# Altium project IPTD_Project.PrjPcb
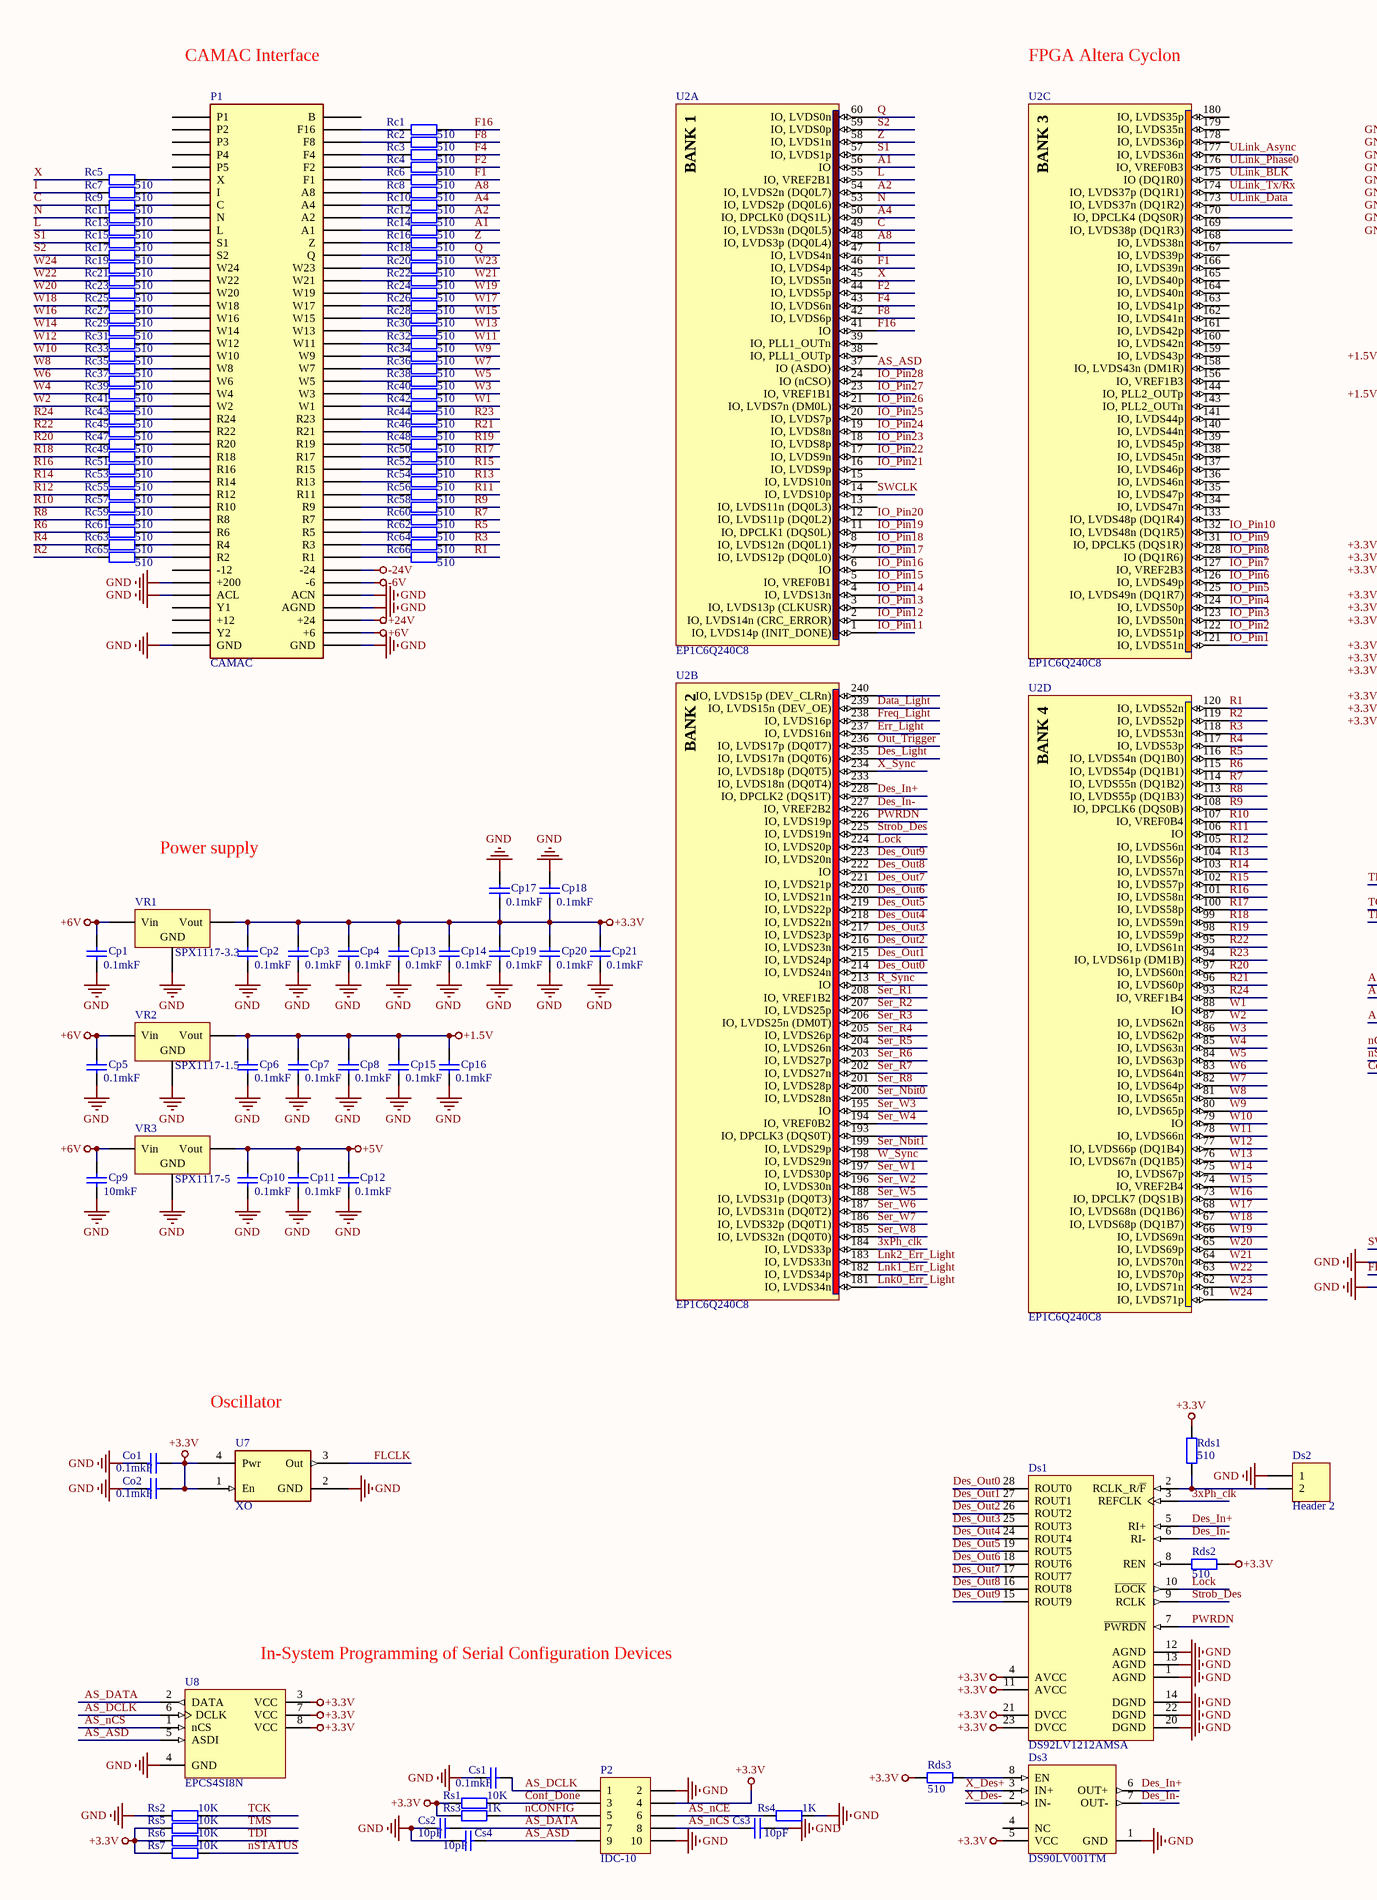
[diagram p0: IPTD.SchDoc, left]
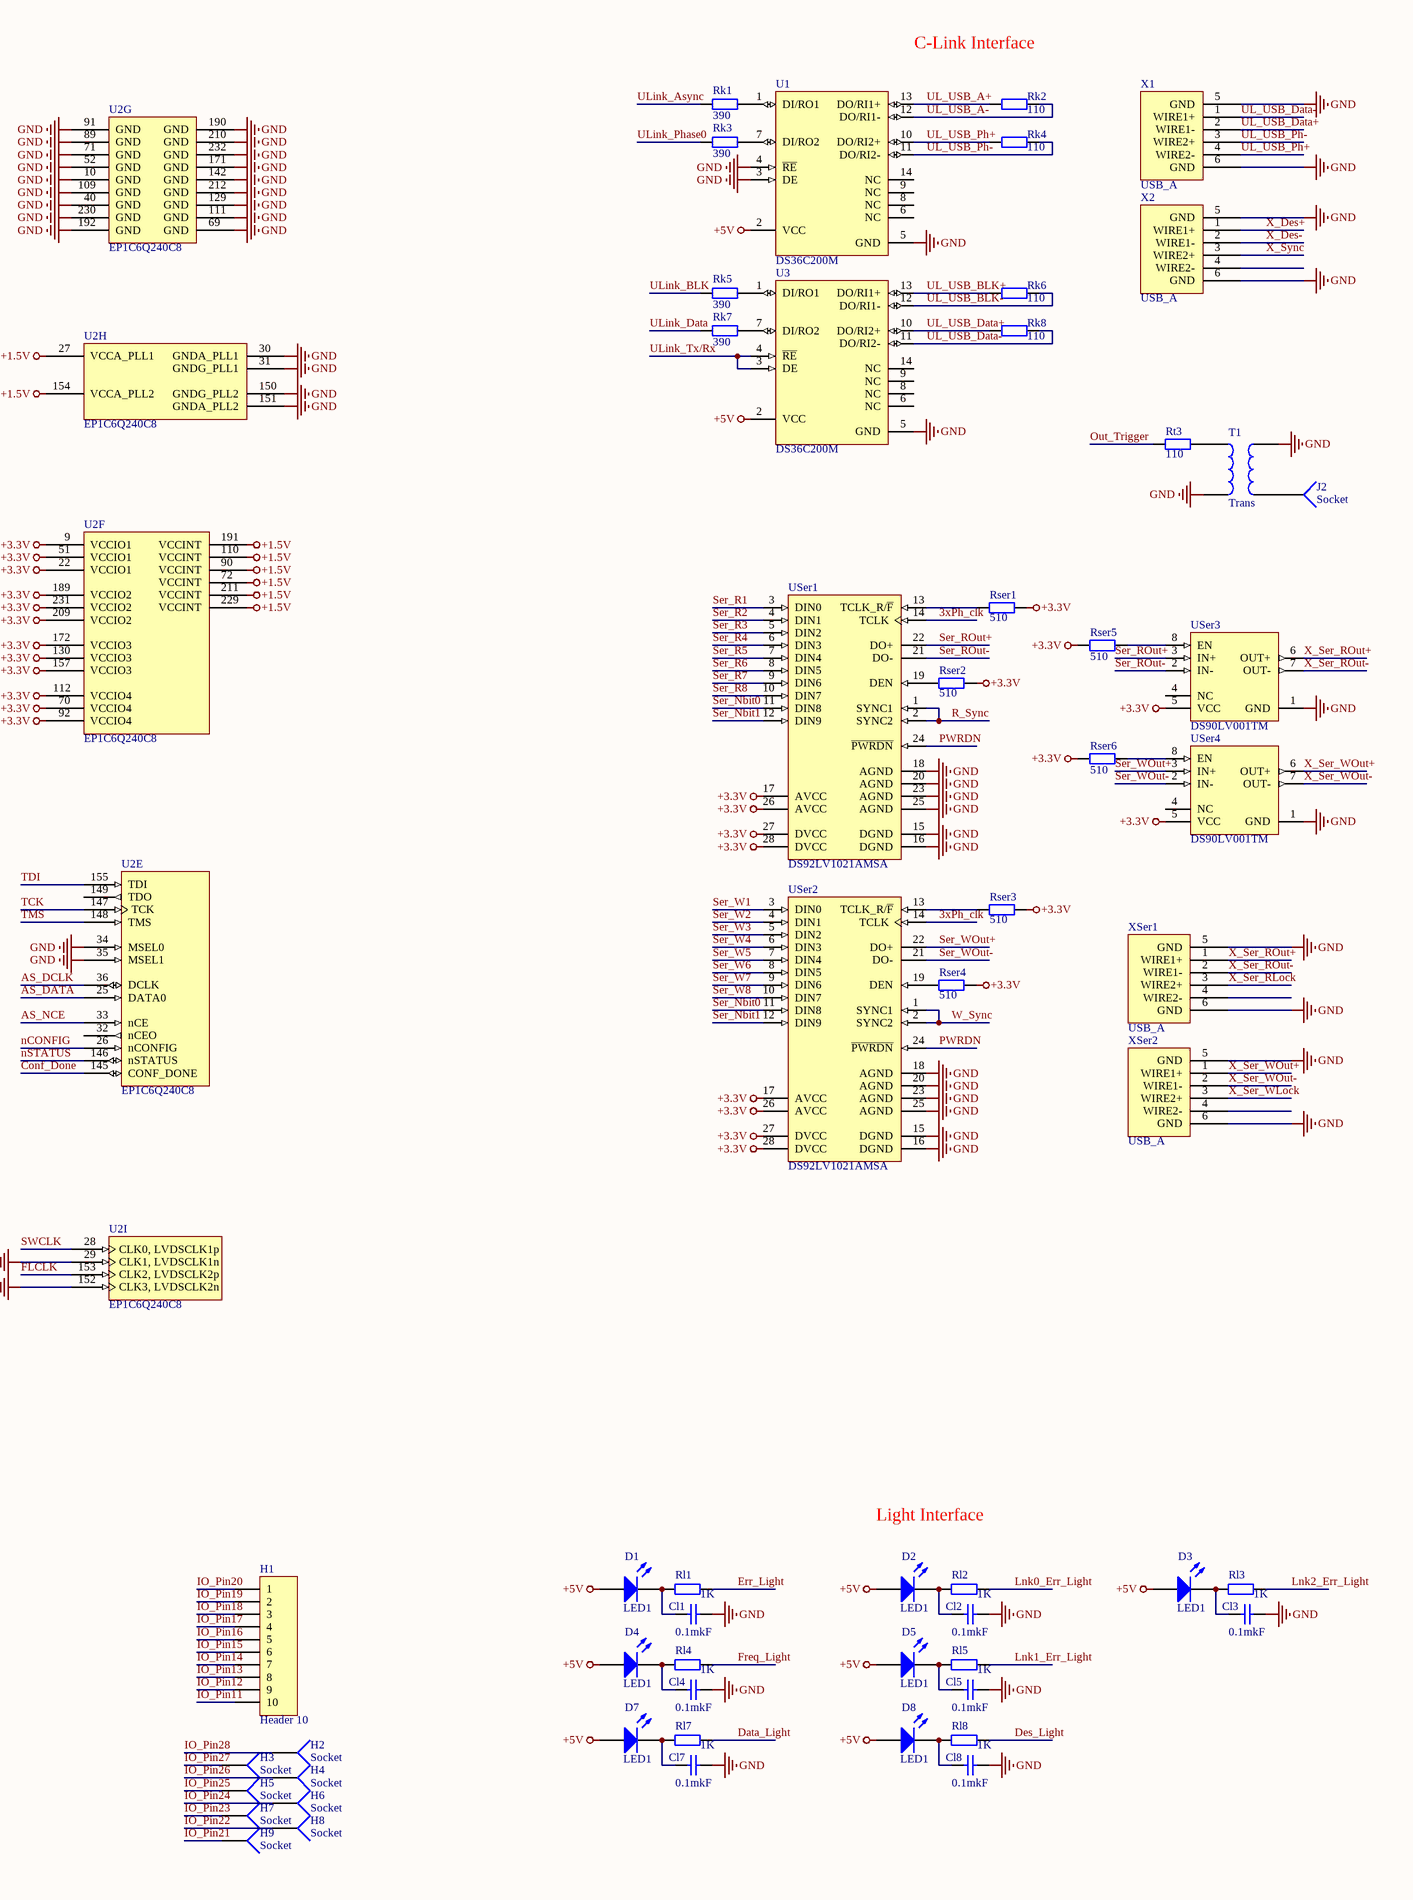
[diagram p1: IPTD.SchDoc, right]
1 sheet, 171 parts. Net scope: global (net labels, ports and power ports of the same name join across sheets).
Board file: IPTD.PcbDoc

## Sheet IPTD.SchDoc
size A2

### Parts
Cl1  value 0.1mkF  [6-0805_N]  (hidden comment: Cap)
Cl2  value 0.1mkF  [6-0805_N]  (hidden comment: Cap)
Cl3  value 0.1mkF  [6-0805_N]  (hidden comment: Cap)
Cl4  value 0.1mkF  [6-0805_N]  (hidden comment: Cap)
Cl5  value 0.1mkF  [6-0805_N]  (hidden comment: Cap)
Cl7  value 0.1mkF  [6-0805_N]  (hidden comment: Cap)
Cl8  value 0.1mkF  [6-0805_N]  (hidden comment: Cap)
Co1  value 0.1mkF  [6-0805_N]  (hidden comment: Cap)
Co2  value 0.1mkF  [6-0805_N]  (hidden comment: Cap)
Cp1  value 0.1mkF  [6-0805_N]  (hidden comment: Cap)
Cp2  value 0.1mkF  [6-0805_N]  (hidden comment: Cap)
Cp3  value 0.1mkF  [6-0805_N]  (hidden comment: Cap)
Cp4  value 0.1mkF  [6-0805_N]  (hidden comment: Cap)
Cp5  value 0.1mkF  [6-0805_N]  (hidden comment: Cap)
Cp6  value 0.1mkF  [6-0805_N]  (hidden comment: Cap)
Cp7  value 0.1mkF  [6-0805_N]  (hidden comment: Cap)
Cp8  value 0.1mkF  [6-0805_N]  (hidden comment: Cap)
Cp9  value 10mkF  [C1210_N]  (hidden comment: Cap)
Cp10  value 0.1mkF  [6-0805_N]  (hidden comment: Cap)
Cp11  value 0.1mkF  [6-0805_N]  (hidden comment: Cap)
Cp12  value 0.1mkF  [6-0805_N]  (hidden comment: Cap)
Cp13  value 0.1mkF  [6-0805_N]  (hidden comment: Cap)
Cp14  value 0.1mkF  [6-0805_N]  (hidden comment: Cap)
Cp15  value 0.1mkF  [6-0805_N]  (hidden comment: Cap)
Cp16  value 0.1mkF  [6-0805_N]  (hidden comment: Cap)
Cp17  value 0.1mkF  [6-0805_N]  (hidden comment: Cap)
Cp18  value 0.1mkF  [6-0805_N]  (hidden comment: Cap)
Cp19  value 0.1mkF  [6-0805_N]  (hidden comment: Cap)
Cp20  value 0.1mkF  [6-0805_N]  (hidden comment: Cap)
Cp21  value 0.1mkF  [6-0805_N]  (hidden comment: Cap)
Cs1  value 0.1mkF  [6-0805_N]  (hidden comment: Cap)
Cs2  value 10pF  [6-0805_N]  (hidden comment: Cap)
Cs3  value 10pF  [6-0805_N]  (hidden comment: Cap)
Cs4  value 10pF  [6-0805_N]  (hidden comment: Cap)
D1  LED1  [LED-1]
D2  LED1  [LED-1]
D3  LED1  [LED-1]
D4  LED1  [LED-1]
D5  LED1  [LED-1]
D7  LED1  [LED-1]
D8  LED1  [LED-1]
Ds1  DS92LV1212AMSA  [MSA28_N]
Ds2  Header 2  [HDR1X2]
Ds3  DS90LV001TM  [M08A_N]
H1  Header 10  [HDR1X10]
H2  Socket  [PIN1]
H3  Socket  [PIN1]
H4  Socket  [PIN1]
H5  Socket  [PIN1]
H6  Socket  [PIN1]
H7  Socket  [PIN1]
H8  Socket  [PIN1]
H9  Socket  [PIN1]
J2  Socket  [PIN1]
P1  CAMAC  [CAMAC]
P2  IDC-10  [HDR2X5]
Rc1  value 510  [6-0805_N]  (hidden comment: Res2)
Rc2  value 510  [6-0805_N]  (hidden comment: Res2)
Rc3  value 510  [6-0805_N]  (hidden comment: Res2)
Rc4  value 510  [6-0805_N]  (hidden comment: Res2)
Rc5  value 510  [6-0805_N]  (hidden comment: Res2)
Rc6  value 510  [6-0805_N]  (hidden comment: Res2)
Rc7  value 510  [6-0805_N]  (hidden comment: Res2)
Rc8  value 510  [6-0805_N]  (hidden comment: Res2)
Rc9  value 510  [6-0805_N]  (hidden comment: Res2)
Rc10  value 510  [6-0805_N]  (hidden comment: Res2)
Rc11  value 510  [6-0805_N]  (hidden comment: Res2)
Rc12  value 510  [6-0805_N]  (hidden comment: Res2)
Rc13  value 510  [6-0805_N]  (hidden comment: Res2)
Rc14  value 510  [6-0805_N]  (hidden comment: Res2)
Rc15  value 510  [6-0805_N]  (hidden comment: Res2)
Rc16  value 510  [6-0805_N]  (hidden comment: Res2)
Rc17  value 510  [6-0805_N]  (hidden comment: Res2)
Rc18  value 510  [6-0805_N]  (hidden comment: Res2)
Rc19  value 510  [6-0805_N]  (hidden comment: Res2)
Rc20  value 510  [6-0805_N]  (hidden comment: Res2)
Rc21  value 510  [6-0805_N]  (hidden comment: Res2)
Rc22  value 510  [6-0805_N]  (hidden comment: Res2)
Rc23  value 510  [6-0805_N]  (hidden comment: Res2)
Rc24  value 510  [6-0805_N]  (hidden comment: Res2)
Rc25  value 510  [6-0805_N]  (hidden comment: Res2)
Rc26  value 510  [6-0805_N]  (hidden comment: Res2)
Rc27  value 510  [6-0805_N]  (hidden comment: Res2)
Rc28  value 510  [6-0805_N]  (hidden comment: Res2)
Rc29  value 510  [6-0805_N]  (hidden comment: Res2)
Rc30  value 510  [6-0805_N]  (hidden comment: Res2)
Rc31  value 510  [6-0805_N]  (hidden comment: Res2)
Rc32  value 510  [6-0805_N]  (hidden comment: Res2)
Rc33  value 510  [6-0805_N]  (hidden comment: Res2)
Rc34  value 510  [6-0805_N]  (hidden comment: Res2)
Rc35  value 510  [6-0805_N]  (hidden comment: Res2)
Rc36  value 510  [6-0805_N]  (hidden comment: Res2)
Rc37  value 510  [6-0805_N]  (hidden comment: Res2)
Rc38  value 510  [6-0805_N]  (hidden comment: Res2)
Rc39  value 510  [6-0805_N]  (hidden comment: Res2)
Rc40  value 510  [6-0805_N]  (hidden comment: Res2)
Rc41  value 510  [6-0805_N]  (hidden comment: Res2)
Rc42  value 510  [6-0805_N]  (hidden comment: Res2)
Rc43  value 510  [6-0805_N]  (hidden comment: Res2)
Rc44  value 510  [6-0805_N]  (hidden comment: Res2)
Rc45  value 510  [6-0805_N]  (hidden comment: Res2)
Rc46  value 510  [6-0805_N]  (hidden comment: Res2)
Rc47  value 510  [6-0805_N]  (hidden comment: Res2)
Rc48  value 510  [6-0805_N]  (hidden comment: Res2)
Rc49  value 510  [6-0805_N]  (hidden comment: Res2)
Rc50  value 510  [6-0805_N]  (hidden comment: Res2)
Rc51  value 510  [6-0805_N]  (hidden comment: Res2)
Rc52  value 510  [6-0805_N]  (hidden comment: Res2)
Rc53  value 510  [6-0805_N]  (hidden comment: Res2)
Rc54  value 510  [6-0805_N]  (hidden comment: Res2)
Rc55  value 510  [6-0805_N]  (hidden comment: Res2)
Rc56  value 510  [6-0805_N]  (hidden comment: Res2)
Rc57  value 510  [6-0805_N]  (hidden comment: Res2)
Rc58  value 510  [6-0805_N]  (hidden comment: Res2)
Rc59  value 510  [6-0805_N]  (hidden comment: Res2)
Rc60  value 510  [6-0805_N]  (hidden comment: Res2)
Rc61  value 510  [6-0805_N]  (hidden comment: Res2)
Rc62  value 510  [6-0805_N]  (hidden comment: Res2)
Rc63  value 510  [6-0805_N]  (hidden comment: Res2)
Rc64  value 510  [6-0805_N]  (hidden comment: Res2)
Rc65  value 510  [6-0805_N]  (hidden comment: Res2)
Rc66  value 510  [6-0805_N]  (hidden comment: Res2)
Rds1  value 510  [6-0805_N]  (hidden comment: Res2)
Rds2  value 510  [6-0805_N]  (hidden comment: Res2)
Rds3  value 510  [6-0805_N]  (hidden comment: Res2)
Rk1  value 390  [6-0805_N]  (hidden comment: Res2)
Rk2  value 110  [6-0805_N]  (hidden comment: Res2)
Rk3  value 390  [6-0805_N]  (hidden comment: Res2)
Rk4  value 110  [6-0805_N]  (hidden comment: Res2)
Rk5  value 390  [6-0805_N]  (hidden comment: Res2)
Rk6  value 110  [6-0805_N]  (hidden comment: Res2)
Rk7  value 390  [6-0805_N]  (hidden comment: Res2)
Rk8  value 110  [6-0805_N]  (hidden comment: Res2)
Rl1  value 1K  [6-0805_N]  (hidden comment: Res2)
Rl2  value 1K  [6-0805_N]  (hidden comment: Res2)
Rl3  value 1K  [6-0805_N]  (hidden comment: Res2)
Rl4  value 1K  [6-0805_N]  (hidden comment: Res2)
Rl5  value 1K  [6-0805_N]  (hidden comment: Res2)
Rl7  value 1K  [6-0805_N]  (hidden comment: Res2)
Rl8  value 1K  [6-0805_N]  (hidden comment: Res2)
Rs1  value 10K  [6-0805_N]  (hidden comment: Res2)
Rs2  value 10K  [6-0805_N]  (hidden comment: Res2)
Rs3  value 1K  [6-0805_N]  (hidden comment: Res2)
Rs4  value 1K  [6-0805_N]  (hidden comment: Res2)
Rs5  value 10K  [6-0805_N]  (hidden comment: Res2)
Rs6  value 10K  [6-0805_N]  (hidden comment: Res2)
Rs7  value 10K  [6-0805_N]  (hidden comment: Res2)
Rser1  value 510  [6-0805_N]  (hidden comment: Res2)
Rser2  value 510  [6-0805_N]  (hidden comment: Res2)
Rser3  value 510  [6-0805_N]  (hidden comment: Res2)
Rser4  value 510  [6-0805_N]  (hidden comment: Res2)
Rser5  value 510  [6-0805_N]  (hidden comment: Res2)
Rser6  value 510  [6-0805_N]  (hidden comment: Res2)
Rt3  value 110  [6-0805_N]  (hidden comment: Res2)
T1  Trans  [TRANS]
U1  DS36C200M  [M14A_N]
U2  EP1C6Q240C8  [PQFP240_N]  (parts A,B,C,D,E,F,G,H,I of 9)
U3  DS36C200M  [M14A_N]
U7  XO  [XO_SMT]
U8  EPCS4SI8N  [SOIC8_N]
USer1  DS92LV1021AMSA  [MSA28_N]
USer2  DS92LV1021AMSA  [MSA28_N]
USer3  DS90LV001TM  [M08A_N]
USer4  DS90LV001TM  [M08A_N]
VR1  SPX1117-3.3  [TO228P970-3_4AN]
VR2  SPX1117-1.5  [TO228P970-3_4AN]
VR3  SPX1117-5  [TO228P970-3_4AN]
X1  USB_A  [USB2.5-2H4B]
X2  USB_A  [USB2.5-2H4B]
XSer1  USB_A  [USB2.5-2H4B]
XSer2  USB_A  [USB2.5-2H4B]

### Nets
+1.5V: Cp6.1 Cp7.1 Cp8.1 Cp15.1 Cp16.1 U2.27(VCCA_PLL1) U2.72(VCCINT) U2.90(VCCINT) U2.110(VCCINT) U2.154(VCCA_PLL2) U2.191(VCCINT) U2.211(VCCINT) U2.229(VCCINT) VR2.4(Vout)
+3.3V: Co1.2 Co2.2 Cp2.1 Cp3.1 Cp4.1 Cp13.1 Cp14.1 Cp17.2 Cp18.2 Cp19.1 Cp20.1 Cp21.1 Ds1.4(AVCC) Ds1.11(AVCC) Ds1.21(DVCC) Ds1.23(DVCC) Ds3.5(VCC) P2.4 Rds1.1 Rds2.2 Rds3.2 Rs1.2 Rs3.2 Rs5.2 Rs6.2 Rs7.2 Rser1.1 Rser2.2 Rser3.1 Rser4.2 Rser5.2 Rser6.2 U2.9(VCCIO1) U2.22(VCCIO1) U2.51(VCCIO1) U2.70(VCCIO4) U2.92(VCCIO4) U2.112(VCCIO4) U2.130(VCCIO3) U2.157(VCCIO3) U2.172(VCCIO3) U2.189(VCCIO2) U2.209(VCCIO2) U2.231(VCCIO2) U7.1(En) U7.4(Pwr) U8.3(VCC) U8.7(VCC) U8.8(VCC) USer1.17(AVCC) USer1.26(AVCC) USer1.27(DVCC) USer1.28(DVCC) USer2.17(AVCC) USer2.26(AVCC) USer2.27(DVCC) USer2.28(DVCC) USer3.5(VCC) USer4.5(VCC) VR1.4(Vout)
+5V: Cp10.1 Cp11.1 Cp12.1 D1.1(A) D2.1(A) D3.1(A) D4.1(A) D5.1(A) D7.1(A) D8.1(A) U1.2(VCC) U3.2(VCC) VR3.4(Vout)
+6V: Cp1.1 Cp5.1 Cp9.1 P1.+6 VR1.3(Vin) VR2.3(Vin) VR3.3(Vin)
+24V: P1.+24
-6V: P1.-6
-24V: P1.-24
GND: Cl1.2 Cl2.2 Cl3.2 Cl4.2 Cl5.2 Cl7.2 Cl8.2 Co1.1 Co2.1 Cp1.2 Cp2.2 Cp3.2 Cp4.2 Cp5.2 Cp6.2 Cp7.2 Cp8.2 Cp9.2 Cp10.2 Cp11.2 Cp12.2 Cp13.2 Cp14.2 Cp15.2 Cp16.2 Cp17.1 Cp18.1 Cp19.2 Cp20.2 Cp21.2 Cs1.2 Cs2.2 Cs3.1 Cs4.2 Ds1.1(AGND) Ds1.12(AGND) Ds1.13(AGND) Ds1.14(DGND) Ds1.20(DGND) Ds1.22(DGND) Ds2.1 Ds3.1(GND) P1.+200 P1.ACL P1.ACN P1.AGND P1.GND1(GND) P1.GND2(GND) P2.2 P2.10 Rs2.2 Rs4.1 T1.2 T1.3 U1.3(DE) U1.4(~{RE}) U1.5(GND) U2.10(GND) U2.29(CLK1,_LVDSCLK1n) U2.30(GNDA_PLL1) U2.31(GNDG_PLL1) U2.34(MSEL0) U2.35(MSEL1) U2.40(GND) U2.52(GND) U2.69(GND) U2.71(GND) U2.89(GND) U2.91(GND) U2.109(GND) U2.111(GND) U2.129(GND) U2.142(GND) U2.150(GNDG_PLL2) U2.151(GNDA_PLL2) U2.152(CLK3,_LVDSCLK2n) U2.171(GND) U2.190(GND) U2.192(GND) U2.210(GND) U2.212(GND) U2.230(GND) U2.232(GND) U3.5(GND) U7.2(GND) U8.4(GND) USer1.15(DGND) USer1.16(DGND) USer1.18(AGND) USer1.20(AGND) USer1.23(AGND) USer1.25(AGND) USer2.15(DGND) USer2.16(DGND) USer2.18(AGND) USer2.20(AGND) USer2.23(AGND) USer2.25(AGND) USer3.1(GND) USer4.1(GND) VR1.1(GND) VR2.1(GND) VR3.1(GND) X1.5(GND) X1.6(GND) X2.5(GND) X2.6(GND) XSer1.5(GND) XSer1.6(GND) XSer2.5(GND) XSer2.6(GND)
3xPh_clk: Ds1.3(REFCLK) U2.184(IO,_LVDS33p) USer1.14(TCLK) USer2.14(TCLK)
A1: Rc14.2 U2.56(IO)
A2: Rc12.2 U2.54(IO,_LVDS2n_(DQ0L7))
A4: Rc10.2 U2.50(IO,_DPCLK0_(DQS1L))
A8: Rc8.2 U2.48(IO,_LVDS3p_(DQ0L4))
AS_ASD: Cs4.1 P2.9 U2.37(IO_(ASDO)) U8.5(ASDI)
AS_DATA: Cs2.1 P2.7 U2.25(DATA0) U8.2(DATA)
AS_DCLK: Cs1.1 P2.1 U2.36(DCLK) U8.6(DCLK)
AS_nCE: P2.6 Rs4.2 U2.33(nCE)
AS_nCS: Cs3.2 P2.8 U8.1(nCS)
C: Rc9.1 U2.49(IO,_LVDS3n_(DQ0L5))
Conf_Done: P2.3 Rs1.1 U2.145(CONF_DONE)
Data_Light: Rl7.1 U2.239(IO,_LVDS15n_(DEV_OE))
Des_In+: Ds1.5(RI+) Ds3.6(OUT+) U2.228(IO,_DPCLK2_(DQS1T))
Des_In-: Ds1.6(RI-) Ds3.7(OUT-) U2.227(IO,_VREF2B2)
Des_Light: Rl8.1 U2.235(IO,_LVDS17n_(DQ0T6))
Des_Out0: Ds1.28(ROUT0) U2.214(IO,_LVDS24n)
Des_Out1: Ds1.27(ROUT1) U2.215(IO,_LVDS24p)
Des_Out2: Ds1.26(ROUT2) U2.216(IO,_LVDS23n)
Des_Out3: Ds1.25(ROUT3) U2.217(IO,_LVDS23p)
Des_Out4: Ds1.24(ROUT4) U2.218(IO,_LVDS22n)
Des_Out5: Ds1.19(ROUT5) U2.219(IO,_LVDS22p)
Des_Out6: Ds1.18(ROUT6) U2.220(IO,_LVDS21n)
Des_Out7: Ds1.17(ROUT7) U2.221(IO,_LVDS21p)
Des_Out8: Ds1.16(ROUT8) U2.222(IO)
Des_Out9: Ds1.15(ROUT9) U2.223(IO,_LVDS20n)
Err_Light: Rl1.1 U2.237(IO,_LVDS16n)
F1: Rc6.2 U2.46(IO,_LVDS4p)
F2: Rc4.2 U2.44(IO,_LVDS5p)
F4: Rc3.2 U2.43(IO,_LVDS6n)
F8: Rc2.2 U2.42(IO,_LVDS6p)
F16: Rc1.2 U2.41(IO)
FLCLK: U2.153(CLK2,_LVDSCLK2p) U7.3(Out)
Freq_Light: Rl4.1 U2.238(IO,_LVDS16p)
I: Rc7.1 U2.47(IO,_LVDS4n)
IO_Pin1: U2.121(IO,_LVDS51n)
IO_Pin2: U2.122(IO,_LVDS51p)
IO_Pin3: U2.123(IO,_LVDS50n)
IO_Pin4: U2.124(IO,_LVDS50p)
IO_Pin5: U2.125(IO,_LVDS49n_(DQ1R7))
IO_Pin6: U2.126(IO,_LVDS49p)
IO_Pin7: U2.127(IO,_VREF2B3)
IO_Pin8: U2.128(IO_(DQ1R6))
IO_Pin9: U2.131(IO,_DPCLK5_(DQS1R))
IO_Pin10: U2.132(IO,_LVDS48n_(DQ1R5))
IO_Pin11: H1.10 U2.1(IO,_LVDS14p_(INIT_DONE))
IO_Pin12: H1.9 U2.2(IO,_LVDS14n_(CRC_ERROR))
IO_Pin13: H1.8 U2.3(IO,_LVDS13p_(CLKUSR))
IO_Pin14: H1.7 U2.4(IO,_LVDS13n)
IO_Pin15: H1.6 U2.5(IO,_VREF0B1)
IO_Pin16: H1.5 U2.6(IO)
IO_Pin17: H1.4 U2.7(IO,_LVDS12p_(DQ0L0))
IO_Pin18: H1.3 U2.8(IO,_LVDS12n_(DQ0L1))
IO_Pin19: H1.2 U2.11(IO,_DPCLK1_(DQS0L))
IO_Pin20: H1.1 U2.12(IO,_LVDS11p_(DQ0L2))
IO_Pin21: H9.1 U2.16(IO,_LVDS9p)
IO_Pin22: H8.1 U2.17(IO,_LVDS9n)
IO_Pin23: H7.1 U2.18(IO,_LVDS8p)
IO_Pin24: H6.1 U2.19(IO,_LVDS8n)
IO_Pin25: H5.1 U2.20(IO,_LVDS7p)
IO_Pin26: H4.1 U2.21(IO,_LVDS7n_(DM0L))
IO_Pin27: H3.1 U2.23(IO,_VREF1B1)
IO_Pin28: H2.1 U2.24(IO_(nCSO))
L: Rc13.1 U2.55(IO,_VREF2B1)
Lnk0_Err_Light: Rl2.1 U2.181(IO,_LVDS34n)
Lnk1_Err_Light: Rl5.1 U2.182(IO,_LVDS34p)
Lnk2_Err_Light: Rl3.1 U2.183(IO,_LVDS33n)
Lock: Ds1.10(~{LOCK}) U2.224(IO,_LVDS20p)
N: Rc11.1 U2.53(IO,_LVDS2p_(DQ0L6))
nCONFIG: P2.5 Rs3.1 U2.26(nCONFIG)
nSTATUS: Rs7.1 U2.146(nSTATUS)
Out_Trigger: Rt3.1 U2.236(IO,_LVDS17p_(DQ0T7))
PWRDN: Ds1.7(~{PWRDN}) U2.226(IO,_LVDS19p) USer1.24(~{PWRDN}) USer2.24(~{PWRDN})
Q: Rc18.2 U2.60(IO,_LVDS0n)
R1: Rc66.2 U2.120(IO,_LVDS52n)
R2: Rc65.1 U2.119(IO,_LVDS52p)
R3: Rc64.2 U2.118(IO,_LVDS53n)
R4: Rc63.1 U2.117(IO,_LVDS53p)
R5: Rc62.2 U2.116(IO,_LVDS54n_(DQ1B0))
R6: Rc61.1 U2.115(IO,_LVDS54p_(DQ1B1))
R7: Rc60.2 U2.114(IO,_LVDS55n_(DQ1B2))
R8: Rc59.1 U2.113(IO,_LVDS55p_(DQ1B3))
R9: Rc58.2 U2.108(IO,_DPCLK6_(DQS0B))
R10: Rc57.1 U2.107(IO,_VREF0B4)
R11: Rc56.2 U2.106(IO)
R12: Rc55.1 U2.105(IO,_LVDS56n)
R13: Rc54.2 U2.104(IO,_LVDS56p)
R14: Rc53.1 U2.103(IO,_LVDS57n)
R15: Rc52.2 U2.102(IO,_LVDS57p)
R16: Rc51.1 U2.101(IO,_LVDS58n)
R17: Rc50.2 U2.100(IO,_LVDS58p)
R18: Rc49.1 U2.99(IO,_LVDS59n)
R19: Rc48.2 U2.98(IO,_LVDS59p)
R20: Rc47.1 U2.97(IO,_LVDS60n)
R21: Rc46.2 U2.96(IO,_LVDS60p)
R22: Rc45.1 U2.95(IO,_LVDS61n)
R23: Rc44.2 U2.94(IO,_LVDS61p_(DM1B))
R24: Rc43.1 U2.93(IO,_VREF1B4)
R_Sync: U2.213(IO) USer1.1(SYNC1) USer1.2(SYNC2)
S1: Rc15.1 U2.57(IO,_LVDS1p)
S2: Rc17.1 U2.59(IO,_LVDS0p)
Ser_Nbit0: U2.200(IO,_LVDS28n) USer1.11(DIN8) USer2.11(DIN8)
Ser_Nbit1: U2.199(IO,_LVDS29p) USer1.12(DIN9) USer2.12(DIN9)
Ser_R1: U2.208(IO,_VREF1B2) USer1.3(DIN0)
Ser_R2: U2.207(IO,_LVDS25p) USer1.4(DIN1)
Ser_R3: U2.206(IO,_LVDS25n_(DM0T)) USer1.5(DIN2)
Ser_R4: U2.205(IO,_LVDS26p) USer1.6(DIN3)
Ser_R5: U2.204(IO,_LVDS26n) USer1.7(DIN4)
Ser_R6: U2.203(IO,_LVDS27p) USer1.8(DIN5)
Ser_R7: U2.202(IO,_LVDS27n) USer1.9(DIN6)
Ser_R8: U2.201(IO,_LVDS28p) USer1.10(DIN7)
Ser_ROut+: USer1.22(DO+) USer3.3(IN+)
Ser_ROut-: USer1.21(DO-) USer3.2(IN-)
Ser_W1: U2.197(IO,_LVDS30p) USer2.3(DIN0)
Ser_W2: U2.196(IO,_LVDS30n) USer2.4(DIN1)
Ser_W3: U2.195(IO) USer2.5(DIN2)
Ser_W4: U2.194(IO,_VREF0B2) USer2.6(DIN3)
Ser_W5: U2.188(IO,_LVDS31p_(DQ0T3)) USer2.7(DIN4)
Ser_W6: U2.187(IO,_LVDS31n_(DQ0T2)) USer2.8(DIN5)
Ser_W7: U2.186(IO,_LVDS32p_(DQ0T1)) USer2.9(DIN6)
Ser_W8: U2.185(IO,_LVDS32n_(DQ0T0)) USer2.10(DIN7)
Ser_WOut+: USer2.22(DO+) USer4.3(IN+)
Ser_WOut-: USer2.21(DO-) USer4.2(IN-)
Strob_Des: Ds1.9(RCLK) U2.225(IO,_LVDS19n)
SWCLK: U2.14(IO,_LVDS10p) U2.28(CLK0,_LVDSCLK1p)
TCK: Rs2.1 U2.147(TCK)
TDI: Rs6.1 U2.155(TDI)
TMS: Rs5.1 U2.148(TMS)
UL_USB_A+: Rk2.2 U1.13(DO/RI1+)
UL_USB_A-: Rk2.1 U1.12(DO/RI1-)
UL_USB_BLK+: Rk6.2 U3.13(DO/RI1+)
UL_USB_BLK-: Rk6.1 U3.12(DO/RI1-)
UL_USB_Data+: Rk8.2 U3.10(DO/RI2+) X1.2(WIRE1-)
UL_USB_Data-: Rk8.1 U3.11(DO/RI2-) X1.1(WIRE1+)
UL_USB_Ph+: Rk4.2 U1.10(DO/RI2+) X1.4(WIRE2-)
UL_USB_Ph-: Rk4.1 U1.11(DO/RI2-) X1.3(WIRE2+)
ULink_Async: Rk1.2 U2.177(IO,_LVDS36n)
ULink_BLK: Rk5.2 U2.175(IO_(DQ1R0))
ULink_Data: Rk7.2 U2.173(IO,_LVDS37n_(DQ1R2))
ULink_Phase0: Rk3.2 U2.176(IO,_VREF0B3)
ULink_Tx/Rx: U2.174(IO,_LVDS37p_(DQ1R1)) U3.3(DE) U3.4(~{RE})
W1: Rc42.2 U2.88(IO)
W2: Rc41.1 U2.87(IO,_LVDS62n)
W3: Rc40.2 U2.86(IO,_LVDS62p)
W4: Rc39.1 U2.85(IO,_LVDS63n)
W5: Rc38.2 U2.84(IO,_LVDS63p)
W6: Rc37.1 U2.83(IO,_LVDS64n)
W7: Rc36.2 U2.82(IO,_LVDS64p)
W8: Rc35.1 U2.81(IO,_LVDS65n)
W9: Rc34.2 U2.80(IO,_LVDS65p)
W10: Rc33.1 U2.79(IO)
W11: Rc32.2 U2.78(IO,_LVDS66n)
W12: Rc31.1 U2.77(IO,_LVDS66p_(DQ1B4))
W13: Rc30.2 U2.76(IO,_LVDS67n_(DQ1B5))
W14: Rc29.1 U2.75(IO,_LVDS67p)
W15: Rc28.2 U2.74(IO,_VREF2B4)
W16: Rc27.1 U2.73(IO,_DPCLK7_(DQS1B))
W17: Rc26.2 U2.68(IO,_LVDS68n_(DQ1B6))
W18: Rc25.1 U2.67(IO,_LVDS68p_(DQ1B7))
W19: Rc24.2 U2.66(IO,_LVDS69n)
W20: Rc23.1 U2.65(IO,_LVDS69p)
W21: Rc22.2 U2.64(IO,_LVDS70n)
W22: Rc21.1 U2.63(IO,_LVDS70p)
W23: Rc20.2 U2.62(IO,_LVDS71n)
W24: Rc19.1 U2.61(IO,_LVDS71p)
W_Sync: U2.198(IO,_LVDS29n) USer2.1(SYNC1) USer2.2(SYNC2)
X: Rc5.1 U2.45(IO,_LVDS5n)
X_Des+: Ds3.3(IN+) X2.1(WIRE1+)
X_Des-: Ds3.2(IN-) X2.2(WIRE1-)
X_Ser_RLock: XSer1.3(WIRE2+)
X_Ser_ROut+: USer3.6(OUT+) XSer1.1(WIRE1+)
X_Ser_ROut-: USer3.7(OUT-) XSer1.2(WIRE1-)
X_Ser_WLock: XSer2.3(WIRE2+)
X_Ser_WOut+: USer4.6(OUT+) XSer2.1(WIRE1+)
X_Ser_WOut-: USer4.7(OUT-) XSer2.2(WIRE1-)
X_Sync: U2.234(IO,_LVDS18p_(DQ0T5)) X2.3(WIRE2+)
Z: Rc16.2 U2.58(IO,_LVDS1n)
NetCl1_1: Cl1.1 D1.2(K) Rl1.2
NetCl2_1: Cl2.1 D2.2(K) Rl2.2
NetCl3_1: Cl3.1 D3.2(K) Rl3.2
NetCl4_1: Cl4.1 D4.2(K) Rl4.2
NetCl5_1: Cl5.1 D5.2(K) Rl5.2
NetCl7_1: Cl7.1 D7.2(K) Rl7.2
NetCl8_1: Cl8.1 D8.2(K) Rl8.2
NetDs1_2: Ds1.2(RCLK_R/~{F}) Ds2.2 Rds1.2
NetDs1_8: Ds1.8(REN) Rds2.1
NetDs3_8: Ds3.8(EN) Rds3.1
NetJ2_1: J2.1 T1.4
NetP1_A1: P1.A1 Rc14.1
NetP1_A2: P1.A2 Rc12.1
NetP1_A4: P1.A4 Rc10.1
NetP1_A8: P1.A8 Rc8.1
NetP1_C: P1.C Rc9.2
NetP1_F1: P1.F1 Rc6.1
NetP1_F2: P1.F2 Rc4.1
NetP1_F4: P1.F4 Rc3.1
NetP1_F8: P1.F8 Rc2.1
NetP1_F16: P1.F16 Rc1.1
NetP1_I: P1.I Rc7.2
NetP1_L: P1.L Rc13.2
NetP1_N: P1.N Rc11.2
NetP1_Q: P1.Q Rc18.1
NetP1_R1: P1.R1 Rc66.1
NetP1_R2: P1.R2 Rc65.2
NetP1_R3: P1.R3 Rc64.1
NetP1_R4: P1.R4 Rc63.2
NetP1_R5: P1.R5 Rc62.1
NetP1_R6: P1.R6 Rc61.2
NetP1_R7: P1.R7 Rc60.1
NetP1_R8: P1.R8 Rc59.2
NetP1_R9: P1.R9 Rc58.1
NetP1_R10: P1.R10 Rc57.2
NetP1_R11: P1.R11 Rc56.1
NetP1_R12: P1.R12 Rc55.2
NetP1_R13: P1.R13 Rc54.1
NetP1_R14: P1.R14 Rc53.2
NetP1_R15: P1.R15 Rc52.1
NetP1_R16: P1.R16 Rc51.2
NetP1_R17: P1.R17 Rc50.1
NetP1_R18: P1.R18 Rc49.2
NetP1_R19: P1.R19 Rc48.1
NetP1_R20: P1.R20 Rc47.2
NetP1_R21: P1.R21 Rc46.1
NetP1_R22: P1.R22 Rc45.2
NetP1_R23: P1.R23 Rc44.1
NetP1_R24: P1.R24 Rc43.2
NetP1_S1: P1.S1 Rc15.2
NetP1_S2: P1.S2 Rc17.2
NetP1_W1: P1.W1 Rc42.1
NetP1_W2: P1.W2 Rc41.2
NetP1_W3: P1.W3 Rc40.1
NetP1_W4: P1.W4 Rc39.2
NetP1_W5: P1.W5 Rc38.1
NetP1_W6: P1.W6 Rc37.2
NetP1_W7: P1.W7 Rc36.1
NetP1_W8: P1.W8 Rc35.2
NetP1_W9: P1.W9 Rc34.1
NetP1_W10: P1.W10 Rc33.2
NetP1_W11: P1.W11 Rc32.1
NetP1_W12: P1.W12 Rc31.2
NetP1_W13: P1.W13 Rc30.1
NetP1_W14: P1.W14 Rc29.2
NetP1_W15: P1.W15 Rc28.1
NetP1_W16: P1.W16 Rc27.2
NetP1_W17: P1.W17 Rc26.1
NetP1_W18: P1.W18 Rc25.2
NetP1_W19: P1.W19 Rc24.1
NetP1_W20: P1.W20 Rc23.2
NetP1_W21: P1.W21 Rc22.1
NetP1_W22: P1.W22 Rc21.2
NetP1_W23: P1.W23 Rc20.1
NetP1_W24: P1.W24 Rc19.2
NetP1_X: P1.X Rc5.2
NetP1_Z: P1.Z Rc16.1
NetRk1_1: Rk1.1 U1.1(DI/RO1)
NetRk3_1: Rk3.1 U1.7(DI/RO2)
NetRk5_1: Rk5.1 U3.1(DI/RO1)
NetRk7_1: Rk7.1 U3.7(DI/RO2)
NetRser1_2: Rser1.2 USer1.13(TCLK_R/~{F})
NetRser2_1: Rser2.1 USer1.19(DEN)
NetRser3_2: Rser3.2 USer2.13(TCLK_R/~{F})
NetRser4_1: Rser4.1 USer2.19(DEN)
NetRser5_1: Rser5.1 USer3.8(EN)
NetRser6_1: Rser6.1 USer4.8(EN)
NetRt3_2: Rt3.2 T1.1

Not connected (* = marked no-connect by the designer): Ds3 4(NC); P1 +12 -12 B P1 P2 P3 P4 P5 Y1 Y2; U1 6(NC) 8(NC) 9(NC) 14(NC); U2 13(IO,_LVDS11n_(DQ0L3)) 15(IO,_LVDS10n) 32(nCEO) 38(IO,_PLL1_OUTp) 39(IO,_PLL1_OUTn) 133(IO,_LVDS48p_(DQ1R4)) 134(IO,_LVDS47n) 135(IO,_LVDS47p) 136(IO,_LVDS46n) 137(IO,_LVDS46p) 138(IO,_LVDS45n) 139(IO,_LVDS45p) 140(IO,_LVDS44n) 141(IO,_LVDS44p) 143(IO,_PLL2_OUTn) 144(IO,_PLL2_OUTp) 149(TDO) 156(IO,_VREF1B3) 158(IO,_LVDS43n_(DM1R)) 159(IO,_LVDS43p) 160(IO,_LVDS42n) 161(IO,_LVDS42p) 162(IO,_LVDS41n) 163(IO,_LVDS41p) 164(IO,_LVDS40n) 165(IO,_LVDS40p) 166(IO,_LVDS39n) 167(IO,_LVDS39p) 168(IO,_LVDS38n) 169(IO,_LVDS38p_(DQ1R3)) 170(IO,_DPCLK4_(DQS0R)) 178(IO,_LVDS36p) 179(IO,_LVDS35n) 180(IO,_LVDS35p) 193(IO,_DPCLK3_(DQS0T)) 233(IO,_LVDS18n_(DQ0T4)) 240(IO,_LVDS15p_(DEV_CLRn)); U3 6(NC) 8(NC) 9(NC) 14(NC); USer3 4(NC); USer4 4(NC); X2 4(WIRE2-); XSer1 4(WIRE2-); XSer2 4(WIRE2-)

### Notes on the sheet
- CAMAC Interface
- FPGA Altera Cyclon
- C-Link Interface
- Power supply
- Oscillator
- Light Interface
- (near U8) In-System Programming of Serial Configuration Devices
- (in symbol EP1C6Q240C8, part A) BANK 1
- (in symbol EP1C6Q240C8, part B) BANK 2
- (in symbol EP1C6Q240C8, part C) BANK 3
- (in symbol EP1C6Q240C8, part D) BANK 4

### Library data of the parts
Cl1-Cl5 Cl7 Cl8 Co1 Co2 Cp1-Cp21 Cs1-Cs4 = Cap: Capacitor; Published: 8-Jun-2000; LatestRevisionDate: 17-Jul-2002; LatestRevisionNote: Re-released for DXP Platform.; PackageReference: RAD-0.3; Publisher: Altium Limited; PackageDescription: Radial Cap, Thru-Hole; 2 Leads; 0.3 in Pin Spacing
D1-D5 D7 D8 = LED1: Typical RED GaAs LED; Published: 8-Jun-2000; LatestRevisionDate: 08-Jul-2005; LatestRevisionNote: Mech Layer 1 removed.; PackageReference: LED-1; Publisher: Altium Limited; PackageDescription: LED; 2 Leads
Ds1 = DS92LV1212AMSA: 16 MHz - 40 MHz 10-Bit Bus LVDS Random Lock Deserializer with Embedded Clock Recovery, 28-pin SSOP-EIAJ; Manufacturer: National Semiconductor; PackageTopMarking: NSUZXYTTE#*DS92LV1212A*MSA; PowerWise: N; CompType: Interface IC; Published: 4-Dec-2008; DatasheetVersion: Nov-2000; PackageVersion: revC, Oct-2009; PackageReference: MSA28; Publisher: Altium Limited; PackageDescription: Molded SSOP, 5.3mm Body Width, 0.65mm Pitch, EIAJ, Type II, 28 Lead; Supplier 1: Farnell; Supplier Part Number 1: 7610683; PartNumber: DS92LV1212AMSA; RoHS: N; PinCount: 28; Code_IPC: SOP65P780-28; ComponentLink1Description: DS92LV1212A Datasheet; ComponentLink1URL: http://www.national.com/ds/DS/DS92LV1212A.pdf; ComponentLink2Description: DS92LV1212A Web Page; ComponentLink2URL: http://www.national.com/pf/DS/DS92LV1212A.html; ComponentLink3Description: MSA28 Package Page; ComponentLink3URL: http://www.national.com/packaging/folders/msa28.html
Ds2 = Header 2: Header, 2-Pin; LatestRevisionDate: 17-Jul-2002; LatestRevisionNote: Re-released for DXP Platform.; Publisher: Altium Limited
Ds3 USer3 USer4 = DS90LV001TM: 800 Mbps LVDS Buffer, 8-pin Narrow SOIC; Manufacturer: National Semiconductor; PackageTopMarking: NSZXTT*LV001*TM; PowerWise: N; CompType: Interface IC; Published: 4-Dec-2008; DatasheetVersion: Feb-2008; PackageVersion: revM, May-2009; PackageReference: M08A; Publisher: Altium Limited; PackageDescription: SOIC Narrow, 4.9 x 3.9 x 1.45mm, 8 Lead, 1.27mm Pitch; PartNumber: DS90LV001TM; RoHS: N; PinCount: 8; Code_JEDEC: MS-012-AA; Code_IPC: SOIC127P600-8; ComponentLink1Description: DS90LV001 Datasheet; ComponentLink1URL: http://www.national.com/ds/DS/DS90LV001.pdf; ComponentLink2Description: DS90LV001 Web Page; ComponentLink2URL: http://www.national.com/pf/DS/DS90LV001.html; ComponentLink3Description: M08A Package Page; ComponentLink3URL: http://www.national.com/packaging/folders/m08a.html
H1 = Header 10: Header, 10-Pin; LatestRevisionDate: 17-Jul-2002; LatestRevisionNote: Re-released for DXP Platform.; Publisher: Altium Limited
P1 = CAMAC: CAMAC module; Published: 8-Jun-2000; LatestRevisionDate: 17-Jul-2002; LatestRevisionNote: Re-released for DXP Platform.; PackageReference: SMB; Publisher: Altium Limited; PackageDescription: DO-214-AA/SMB; 2 C-Bend Leads; Body 5.3 x 3.6 mm, inc. leads (LxW); Code_JEDEC: DO-214-AA
P2 = Header 5X2: Header, 5-Pin, Dual row; LatestRevisionDate: 17-Jul-2002; LatestRevisionNote: Re-released for DXP Platform.; Publisher: Altium Limited
Rc1-Rc66 Rds1-Rds3 Rk1-Rk8 Rl1-Rl5 Rl7 Rl8 Rs1-Rs7 Rser1-Rser6 Rt3 = Res2: Resistor; Published: 8-Jun-2000; LatestRevisionDate: 17-Jul-2002; LatestRevisionNote: Re-released for DXP Platform.; PackageReference: AXIAL-0.4; Publisher: Altium Limited; PackageDescription: Axial Device, Thru-Hole; 2 Leads; 0.4 in Pin Spacing
T1 = Trans: Transformer; Published: 24-Mar-1999; LatestRevisionDate: 08-Jul-2005; LatestRevisionNote: Mech Layer 1 removed.; PackageReference: TRANS; Publisher: Altium Limited; PackageDescription: Transformer; 4 Leads
U1 U3 = DS36C200M: Dual High Speed Bi-Directional Differential Transceiver, 14-pin Narrow SOIC; Manufacturer: National Semiconductor; PackageTopMarking: NSUZXYTTE#*DS36C200M; PowerWise: N; CompType: Interface IC; Published: 4-Dec-2008; DatasheetVersion: Feb-2005; PackageVersion: revJ, Jan-1996; PackageReference: M14A; Publisher: Altium Limited; PackageDescription: Molded Package S.O., .150in Wide, 14 Lead; Supplier 1: Farnell; Supplier Part Number 1: 9494189; PartNumber: DS36C200M; RoHS: N; PinCount: 14; Code_JEDEC: MS-012AB; Code_IPC: SOIC127P600-14; ComponentLink1Description: DS36C200 Datasheet; ComponentLink1URL: http://www.national.com/ds/DS/DS36C200.pdf; ComponentLink2Description: DS36C200 Web Page; ComponentLink2URL: http://www.national.com/pf/DS/DS36C200.html; ComponentLink3Description: M14A Package Page; ComponentLink3URL: http://www.national.com/packaging/folders/m14a.html
U2 = EP1C6Q240C8: Cyclone Family, 1.5V FPGA, 185 I/O Pins, 2 x PLLs, Commercial Grade, Speed Grade 8; Published: 17-Sep-2003; LatestRevisionDate: 13-Apr-2006; LatestRevisionNote: Pin 2 name fix, IPC-7351 Footprint Added.; DatasheetVersion: ver2.4, May-2008; PackageVersion: ver15.4, Dec-2008; PackageReference: PQFP240; Publisher: Altium Limited; PackageDescription: 240-Pin Plastic Quad Flat Pack (PQFP240) - Wire Bond; Supplier 1: Digi-Key; Supplier Part Number 1: 544-1085-ND; Code_JEDEC: MS-029-GA; ComponentLink1Description: Manufacturer Link; ComponentLink1URL: http://www.altera.com/products/devices/cyclone/cyc-index.jsp; ComponentLink2Description: Handbook; ComponentLink2URL: http://www.altera.com/literature/hb/cyc/cyc_c5v1.pdf; ComponentLink3Description: Packaging Specification; ComponentLink3URL: http://www.altera.com/literature/ds/dspkg.pdf
U7 = XO: XO (quartz); Published: 8-Jun-2000; LatestRevisionDate: 17-Jul-2002; LatestRevisionNote: Re-released for DXP Platform.; PackageReference: SMB; Publisher: Altium Limited; PackageDescription: DO-214-AA/SMB; 2 C-Bend Leads; Body 5.3 x 3.6 mm, inc. leads (LxW); Code_JEDEC: DO-214-AA
U8 = EPCS4SI8N: EPCS4 Series, In-system programmable 3.3V serial configuration device, 8-Pin SOIC, 4-Megabit, Industrial Grade, Pb-Free; Configures: Cyclone II, Stratix II, & Cyclone Devices; Published: 4-Mar-2005; LatestRevisionDate: 13-Apr-2006; LatestRevisionNote: IPC-7351 Footprint Added.; DatasheetVersion: ver2.0, Oct-2003; PackageVersion: ver14.2, Oct-2005; PackageReference: SOIC8; Publisher: Altium Limited; PackageDescription: 8-Pin Small Outline Integrated Circuit Package (SOIC8); Supplier 1: Digi-Key; Supplier Part Number 1: 544-1379-5-ND; Supplier 2: Farnell; Supplier Part Number 2: 1662262; Supplier 3: Farnell; Supplier Part Number 3: 1453496; Code_JEDEC: MS-012-AA; Code_IPC: SOIC127P600-8; ComponentLink1Description: Manufacturer Link; ComponentLink1URL: http://www.altera.com/products/devices/config/cfg-index.html; ComponentLink2Description: Configuration Handbook; ComponentLink2URL: http://www.altera.com/literature/hb/cfg/config_handbook.pdf; ComponentLink3Description: Pinout Specification; ComponentLink3URL: http://www.altera.com/literature/hb/cfg/cyc_c51014.pdf; ComponentLink4Description: Packaging Specification; ComponentLink4URL: http://www.altera.com/literature/ds/dspkg.pdf
USer1 USer2 = DS92LV1021AMSA: 16 MHz - 40 MHz 10-Bit Serializer, 28-pin SSOP-EIAJ; Manufacturer: National Semiconductor; PackageTopMarking: NSUZXYTTE#*DS92LV1021A*MSA BBBBB; PowerWise: N; CompType: Interface IC; Published: 4-Dec-2008; DatasheetVersion: Jan-2003; PackageVersion: revC, Oct-2009; PackageReference: MSA28; Publisher: Altium Limited; PackageDescription: Molded SSOP, 5.3mm Body Width, 0.65mm Pitch, EIAJ, Type II, 28 Lead; Supplier 1: Farnell; Supplier Part Number 1: 8206830; PartNumber: DS92LV1021AMSA; RoHS: N; PinCount: 28; Code_IPC: SOP65P780-28; ComponentLink1Description: DS92LV1021A Datasheet; ComponentLink1URL: http://www.national.com/ds/DS/DS92LV1021A.pdf; ComponentLink2Description: DS92LV1021A Web Page; ComponentLink2URL: http://www.national.com/pf/DS/DS92LV1021A.html; ComponentLink3Description: MSA28 Package Page; ComponentLink3URL: http://www.national.com/packaging/folders/msa28.html
VR1-VR3 = Volt Reg: Voltage Regulator; Published: 24-Mar-1999; LatestRevisionDate: 29-May-2009; LatestRevisionNote: IPC-7351 Footprint Added.; PackageReference: D2PAK; Publisher: Altium Limited; PackageDescription: 3-Pin Transistor Outline Package 2.54 mm Pitch, 15.1 mm Lead Span
X1 X2 XSer1 XSer2 = USB_A: Connector USB A; Published: 8-Jun-2000; LatestRevisionDate: 17-Jul-2002; LatestRevisionNote: Re-released for DXP Platform.; PackageReference: SMB; Publisher: Altium Limited; PackageDescription: DO-214-AA/SMB; 2 C-Bend Leads; Body 5.3 x 3.6 mm, inc. leads (LxW); Code_JEDEC: DO-214-AA
H2-H9 J2 = Socket: LatestRevisionDate: 17-Jul-2002; LatestRevisionNote: Re-released for DXP Platform.; Publisher: Altium Limited